# EAGLE design goprocontrol (EAGLE 7.6.0)
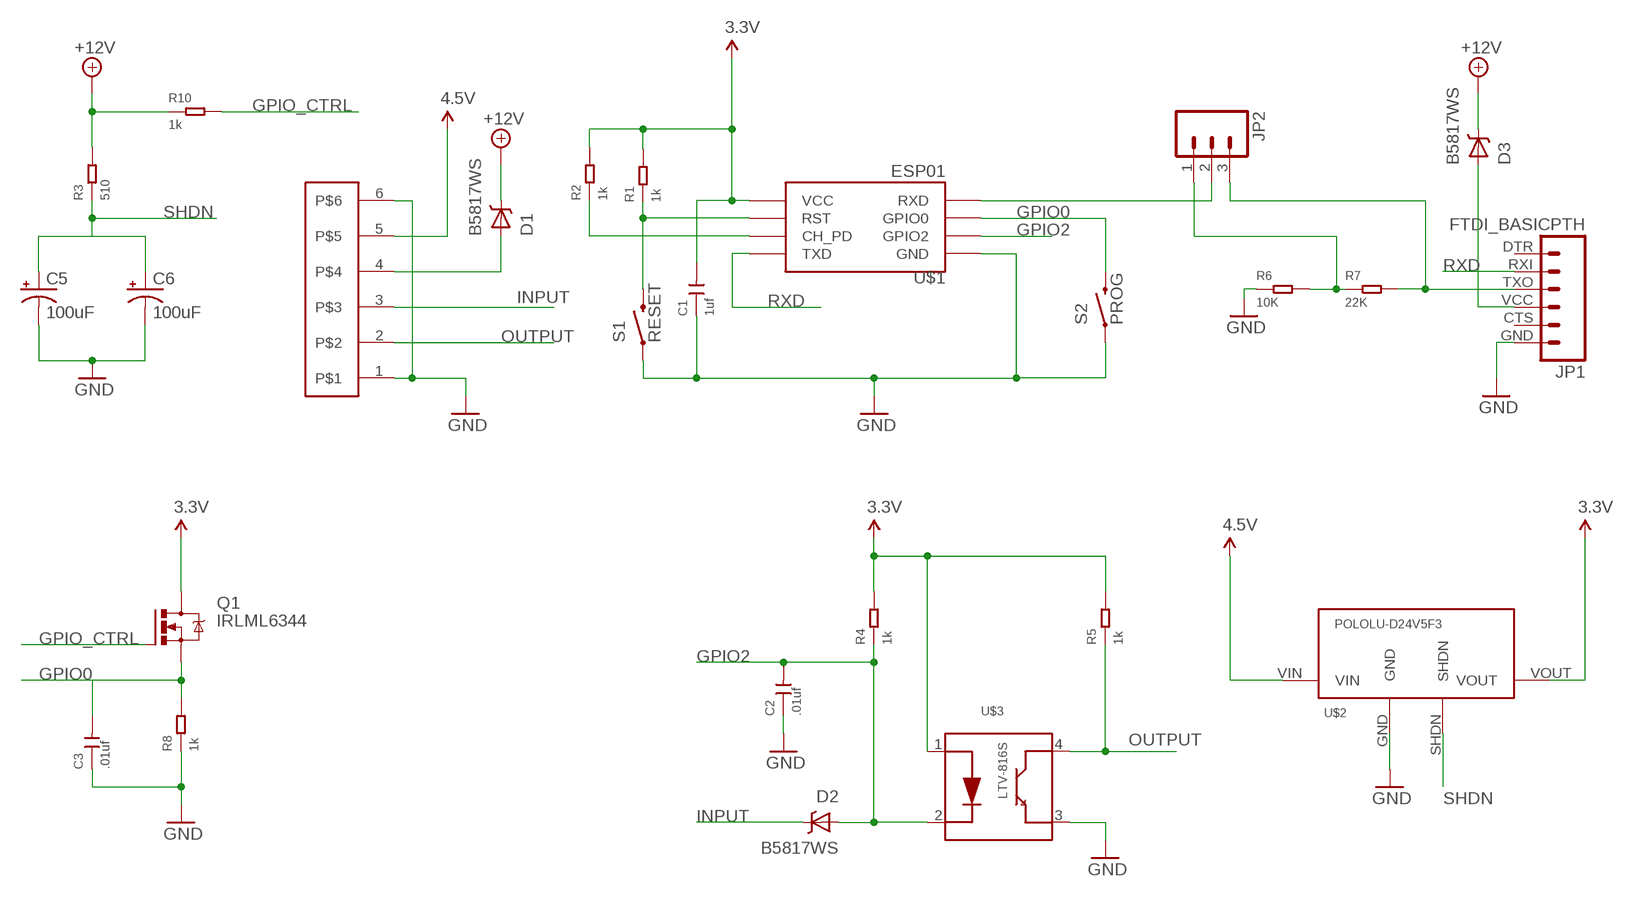
[diagram p0: schematic, sheet 1]

## Parts
C1  1uf  CERAMIC-1UF-25V-10%-X7R(0805)  [C0805]
C2  .01uf  CERAMIC-1UF-25V-10%-X7R(0805)  [C0805]
C3  .01uf  CERAMIC-1UF-25V-10%-X7R(0805)  [C0805]
C5  100uF  CAP_POLPTH1  [CPOL-RADIAL-100UF-25V]
C6  100uF  CAP_POLPTH1  [CPOL-RADIAL-100UF-25V]
D1  B5817WS  SCHOTTKY-DIODE  [SOD-323]
D2  B5817WS  SCHOTTKY-DIODE  [SOD-323]
D3  B5817WS  SCHOTTKY-DIODE  [SOD-323]
JP1  FTDI_BASICPTH  [FTDI_BASIC]
JP2  M03PTH  [1X03]
Q1  IRLML6344  [SOT23]
R1  1k  SMD-RES-10K-1%-1/8W(0805)  [R0805]
R2  1k  SMD-RES-10K-1%-1/8W(0805)  [R0805]
R3  510  SMD-RES-10K-1%-1/8W(0805)  [R0805]
R4  1k  SMD-RES-10K-1%-1/8W(0805)  [R0805]
R5  1k  SMD-RES-10K-1%-1/8W(0805)  [R0805]
R6  10K  SMD-RES-10K-1%-1/8W(0805)  [R0805]
R7  22K  SMD-RES-22K-5%-1/8W(0805)  [R0805]
R8  1k  SMD-RES-100K-1%-1/8W(0805)  [R0805]
R10  1k  SMD-RES-10K-1%-1/8W(0805)  [R0805]
S1  RESET  SWITCH-MOMENTARY-2PTH  [TACTILE-PTH]
S2  PROG  SWITCH-MOMENTARY-2PTH  [TACTILE-PTH]
U$1  ESP01  [ESP01]
U$2  POLOLU-D24V5F3  POLOLU-D24V5FD24V5F  [POLOLU-D24V5FX]
U$3  LTV-816S  SMD-PHOTOCOUPLER-5KV-LTV-816S(4P-4.6X6.5MM)  [SMD4-2.54-4.6X6.5MM]
U$4  TERM-BLOCK-P6-3.5  [TERM-6P-3.5]

## Nets
3.3V [3.3V]: C1.2 Q1.3(D) R1.2 R2.2 R4.2 R5.2 U$1.VCC U$2.VOUT U$3.1(ANODE)
3.3V-TX: JP1.TXO JP2.3 R7.2
5V-TX: JP2.1 R6.2 R7.1
+12V [12V]: D1.C1(C) D3.C1(C) R3.2 R10.1
GND: C1.1 C2.1 C3.1 C5.2(-) C6.2(-) JP1.GND R6.1 R8.1 S1.1 S2.1 U$1.GND U$2.GND U$3.3(EMITER) U$4.1 U$4.6
GPIO0: C3.2 Q1.2(S) R8.2 S2.3 U$1.GPIO0
GPIO2: C2.2 D2.A1(A) R4.1 U$1.GPIO2 U$3.2(CATHODE)
GPIO_CTRL: Q1.1(G) R10.2
INPUT: D2.C1(C) U$4.3
N$1: R2.1 U$1.CH_PD
N$3: R1.1 S1.3 U$1.RST
N$4 [12V]: D3.A1(A) JP1.VCC
N$6 [12V]: D1.A1(A) U$4.4
OUTPUT: R5.1 U$3.4(COLLECTOR) U$4.2
RXD: JP1.RXI U$1.TX(TXD)
SHDN: C5.1(+) C6.1(+) R3.1 U$2.SHDN
TXD: JP2.2 U$1.RX(RXD)
V_BATT: U$2.VIN U$4.5 ; supply symbol labelled 4.5V
Unconnected: JP1.CTS JP1.DTR

## Library data of the parts
C1 = Seeed-OPL-Capacitor:CERAMIC-1UF-25V-10%-X7R(0805): 302010179; MPN: CC0805KKX7R8BB105
C2 C3 = Seeed-OPL-Capacitor:CERAMIC-1UF-25V-10%-X7R(0805): 302010179; MPN: CC0805KKX7R8BB105; VALUE: 1uf
C5 C6 = SparkFun-Capacitors:CAP_POL: Capacitor Polarized These are standard SMD and PTH capacitors. Normally 10uF, 47uF, and 100uF in electrolytic and tantalum varieties. Always verify the external diameter of the through hole cap, it varies with capacity, voltage, and manufacturer. The EIA devices should be standard.
D1-D3 = synfinatic:SCHOTTKY-DIODE
JP1 = SparkFun-Connectors:FTDI_BASIC: FTDI Basic header with labels
JP2 = SparkFun-Connectors:M03: Header 3 Standard 3-pin 0.1" header. Use with straight break away headers (SKU : PRT-00116), right angle break away headers (PRT-00553), swiss pins (PRT-00743), machine pins (PRT-00117), and female headers (PRT-00115). Molex polarized connector foot print use with SKU : PRT-08232 with associated crimp pins and housings.
Q1 = synfinatic:IRLML6344: N-CHANNEL MOS FET
R1-R5 R10 = Seeed-OPL-Resistor:SMD-RES-10K-1%-1/8W(0805): 301010361; MPN: RC0805FR-0710KL; VALUE: 10K
R6 = Seeed-OPL-Resistor:SMD-RES-10K-1%-1/8W(0805): 301010361; MPN: RC0805FR-0710KL
R7 = Seeed-OPL-Resistor:SMD-RES-22K-5%-1/8W(0805): 301010341; MPN: RC0805JR-0722KL
R8 = Seeed-OPL-Resistor:SMD-RES-100K-1%-1/8W(0805): 301010396; MPN: RC0805FR-07100KL; VALUE: 100K
S1 S2 = SparkFun-Electromechanical:SWITCH-MOMENTARY-2: Various NO switches- pushbuttons, reed, etc
U$1 = esp8266modules:ESP01: ESP8266 Wifi module 01
U$2 = synfinatic:POLOLU-D24V5F: Pololu D24V5FX and D24V6F Step Down Voltage Regulators 0.4" x 0.5" 500ma or 600ma <= 24V input and 3.3, 5, 9 or 12V output
U$3 = Seeed-OPL-Transistor:SMD-PHOTOCOUPLER-5KV-LTV-816S(4P-4.6X6.5MM): 306060007; MPN: LTV-816S
U$4 = synfinatic:TERM-BLOCK-P6-3.5

## Net classes
1 12V: width 1 mm
2 3.3V: width 1 mm

## Board
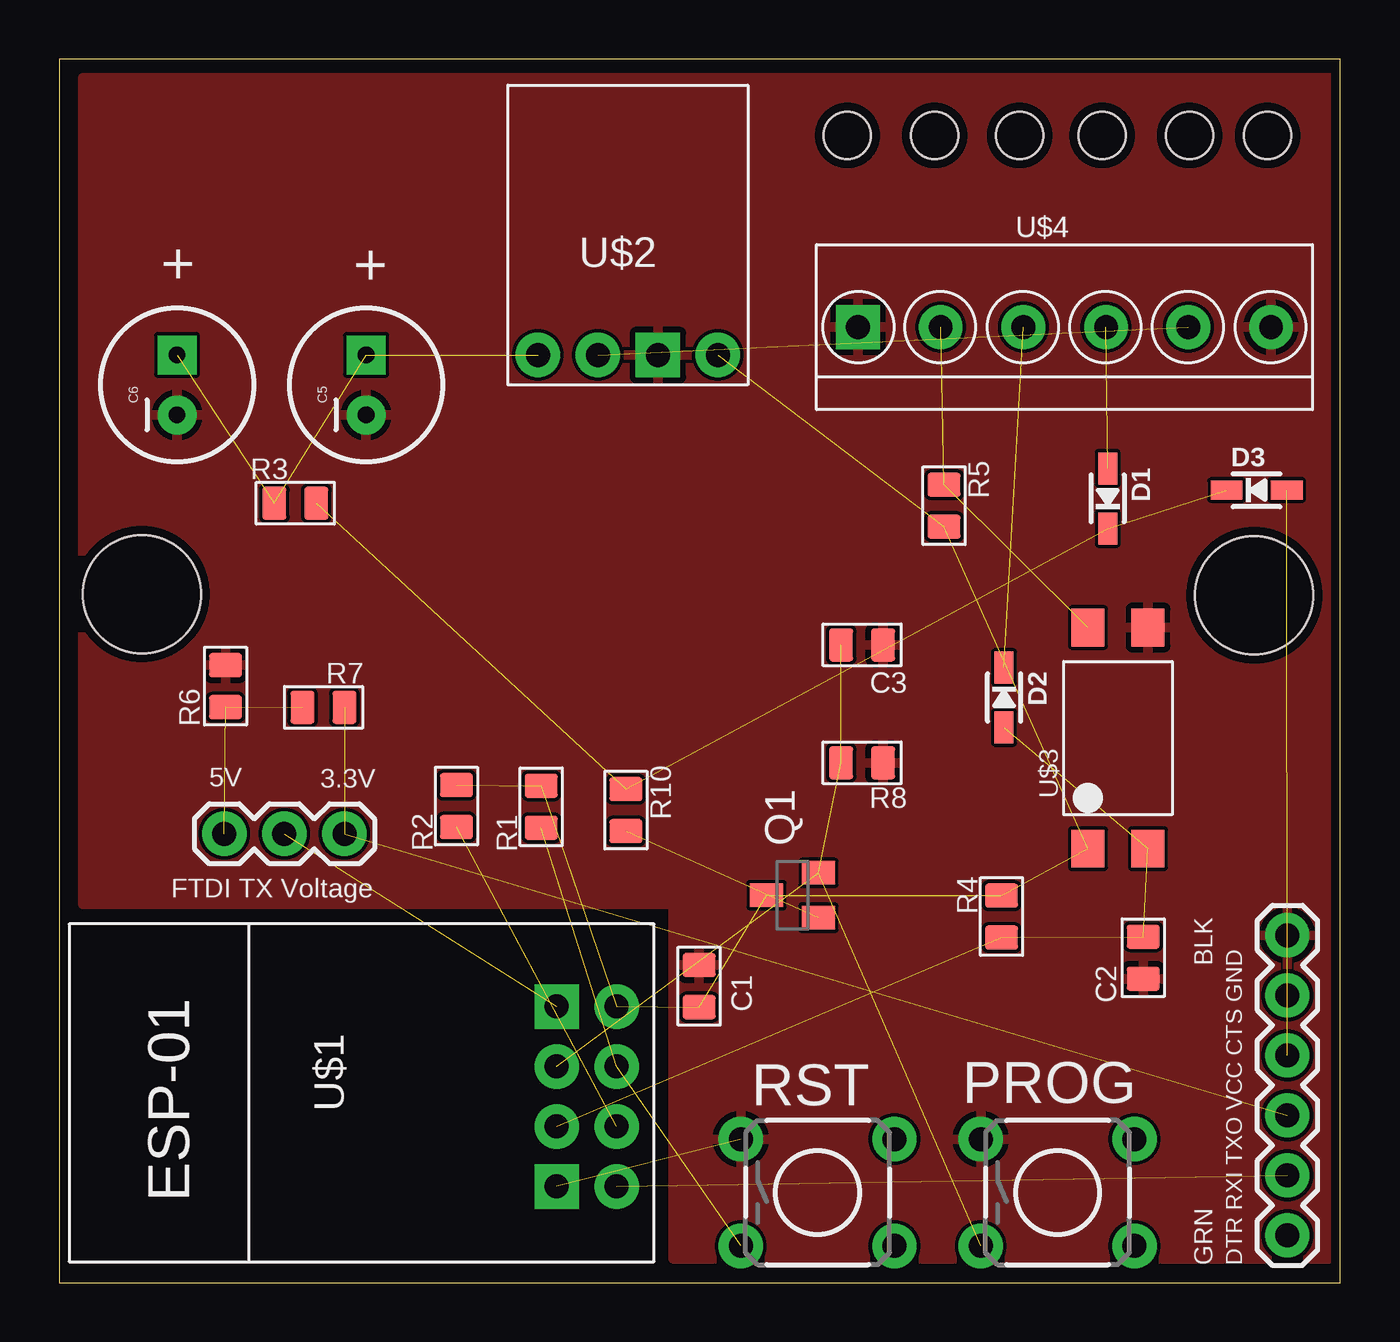
[diagram p1: board, top side]
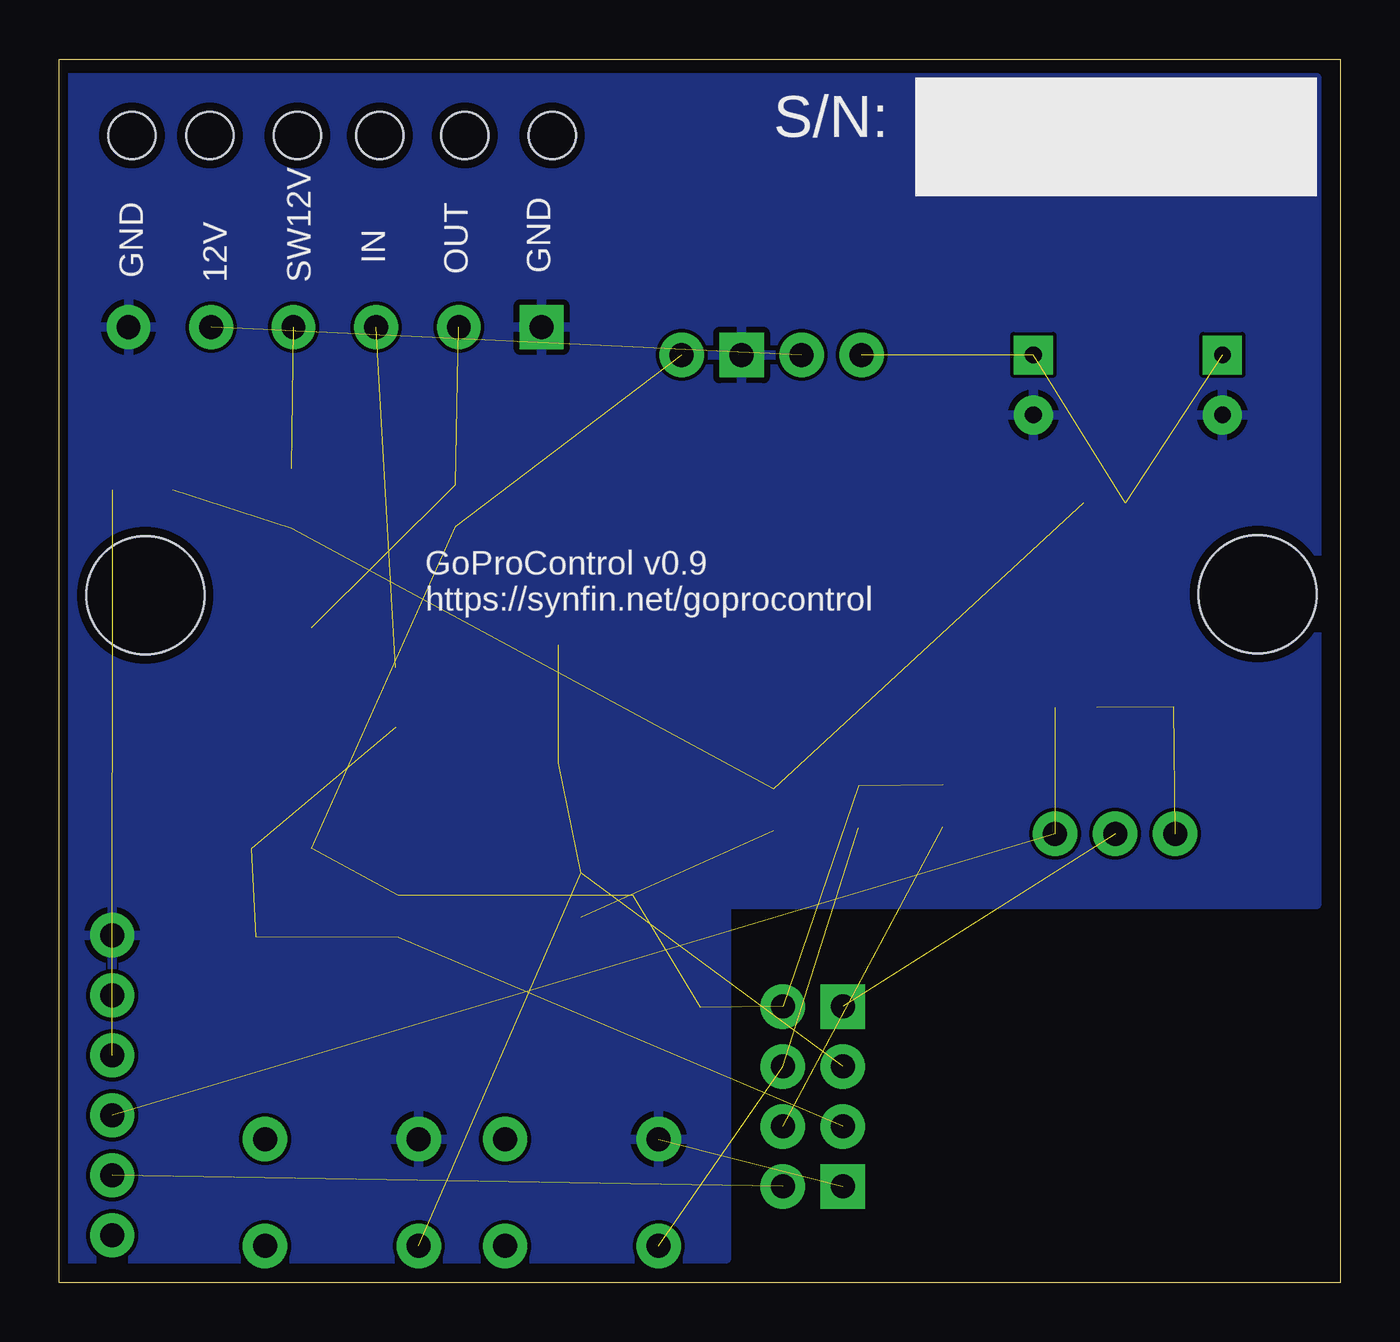
[diagram p2: board, bottom side, seen from below]

Size 54.25 x 51.8 mm. Coordinates in mm from the lower left corner, seen from the top.
Outline: 0,0 54.25,0 54.25,51.8 0,51.8 0,0
Copper layers (1*16): Top 0.0356mm / dielectric 1.5011mm / Bottom 0.0356mm
Design rules "LaenPCBOrder *": minimum track width 6mil, minimum drill 13mil, track to track 6mil, track to pad 6mil, pad to pad 6mil, via to via 6mil, smd to smd 6mil, copper to edge 15mil, drill to drill 6mil, minimum pad ring 7mil, minimum via ring 7mil, stop-mask expansion 4mil, vias tented up to drill 35mil, thermal gap 10mil
Holes 2 mm at 33.38,48.56 37.07,48.56 40.66,48.56 44.16,48.56 47.86,48.56 51.16,48.56
Holes 5 mm at 3.5,29.15 50.6,29.1

### Footprints (pad centres in the part's own frame; a part is rotated, then mirrored left to right if it is on the bottom)
C0805 = smd 1.397 x 1.016: 1 0,0.889; 2 0,-0.889
CPOL-RADIAL-100UF-25V = drill 0.7 pad 1.651 square: 1 1.27,0 | drill 0.7 pad 1.651: 2 -1.27,0
SOD-323 = smd 1.35 x 0.8: A1 1.27,0; C1 -1.27,0
FTDI_BASIC = drill 1.016 pad 1.88: CTS 10.16,0; DTR 0,0; GND 12.7,0; RXI 2.54,0; TXO 5.08,0; VCC 7.62,0
1X03 = drill 1.016 pad 1.88: 1 0,0; 2 2.54,0; 3 5.08,0
SOT23 = smd 1 x 1.4: 1 -0.95,-1.1; 2 0.95,-1.1; 3 0,1.1
R0805 = smd 1.397 x 1.016: 1 0,0.889; 2 0,-0.889
TACTILE-PTH = drill 1.016 pad 1.88: 1 -3.251,2.261; 2 3.251,2.261; 3 -3.251,-2.261; 4 3.251,-2.261
ESP01 = drill 1.016 pad 1.88: CH_PD -1.285,-8.178; GPIO0 1.255,-5.638; GPIO2 -1.285,-5.638; RST 1.255,-8.178; TX -3.825,-8.178; VCC 3.795,-8.178 | drill 1.016 pad 1.88 square: GND -3.825,-5.638; RX 3.795,-5.638
POLOLU-D24V5FX = drill 1.016 pad 1.88 square: GND 6.35,1.27 | drill 1.016 pad 1.88: SHDN 1.27,1.27; VIN 3.81,1.27; VOUT 8.89,1.27
SMD4-2.54-4.6X6.5MM = smd 1.4 x 1.6: 1 -1.27,-4.68; 2 1.27,-4.68; 3 1.27,4.68; 4 -1.27,4.68
TERM-6P-3.5 = drill 1 pad 1.85 square: 1 -5.075,0 | drill 1 pad 1.85: 2 -1.575,0; 3 1.925,0; 4 5.425,0; 5 8.91,0; 6 12.41,0

### Placement (x,y rotation side)
C1  27.1,12.55 0 top
C2  45.9,13.75 180 top
C3  34,27 270 top
C5  13,38 90 top
C6  5,38 90 top
D1  44.4,33.2 90 top
D2  40.01,24.77 270 top
D3  50.7,33.55 0 top
JP1  52,2 90 top
JP2  7,19 0 top
Q1  31.05,16.4 90 top
R1  20.41,20.14 180 top
R2  16.83,20.17 180 top
R3  10,33 90 top
R4  39.9,15.5 180 top
R5  37.47,32.9 0 top
R6  7.05,25.25 0 top
R7  11.2,24.35 90 top
R8  34,22 270 top
R10  24,20 0 top
S1  32.12,3.81 0 top
S2  42.27,3.81 0 top
U$1  15.43,7.89 90 top
U$2  19,38 0 top
U$3  44.83,23.05 0 top
U$4  38.9,40.45 0 top

### Tracks (layer width: path | path; a pad name or v marks a point on that pad's centre or on a via)
3.3V  (8 unrouted)
3.3V-TX  (2 unrouted)
5V-TX  (2 unrouted)
+12V  (3 unrouted)
GND  (1 unrouted)
  pour Top: 1,51 54,51 54,1 26,1 26,16 1,16
  pour Bottom: 1,51 54,51 54,1 26,1 26,16 1,16
GPIO0  (4 unrouted)
GPIO2  (4 unrouted)
GPIO_CTRL  (1 unrouted)
INPUT  (1 unrouted)
N$1  (1 unrouted)
N$3  (2 unrouted)
N$4  (1 unrouted)
N$6  (1 unrouted)
OUTPUT  (2 unrouted)
RXD  (1 unrouted)
SHDN  (3 unrouted)
TXD  (1 unrouted)
V_BATT  (1 unrouted)

### Text on the board
tPlace: U$2 | 5V | 3.3V | FTDI TX Voltage
tNames: + | + | RST | PROG
bNames: S/N: | GND | OUT | IN | GND | SW12V | 12V | GoProControl v0.9 / https://synfin.net/goprocontrol